# Altium project motor_board.PrjPcb
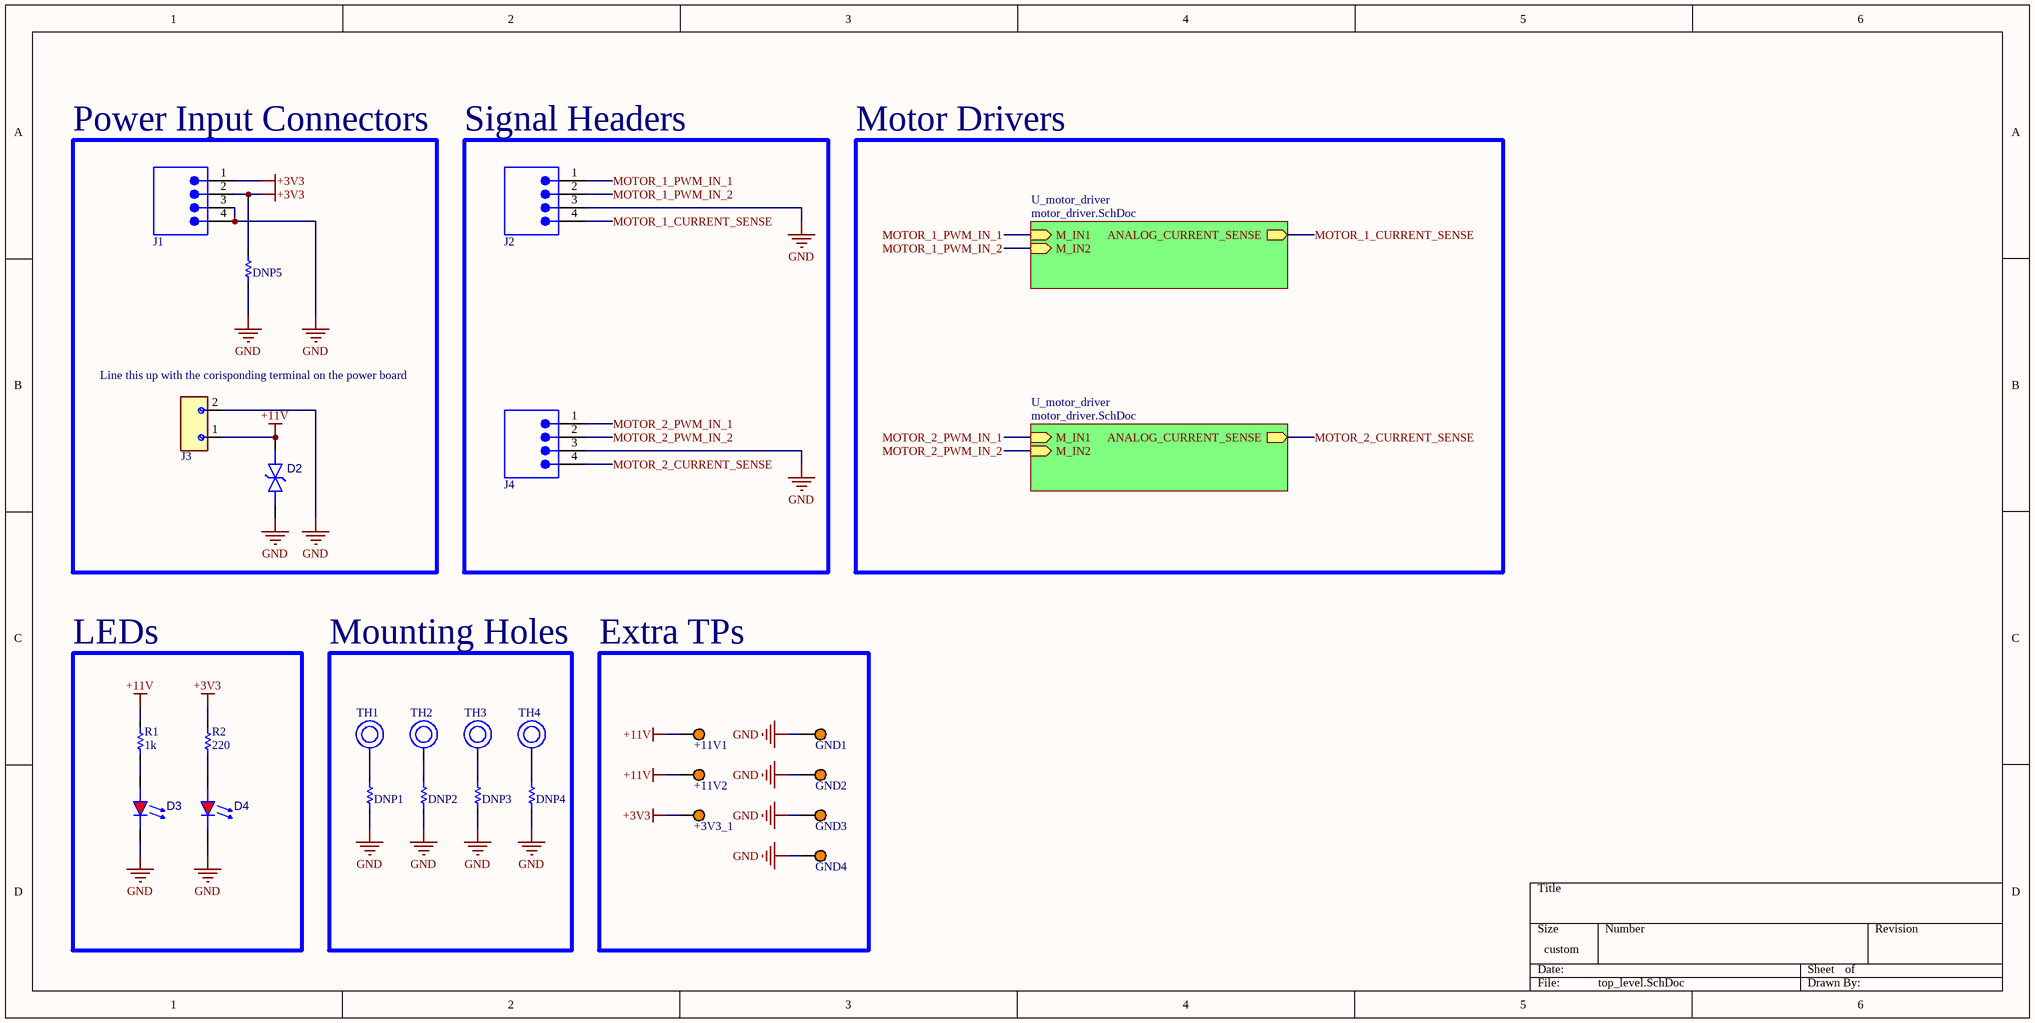
[diagram p0: top_level.SchDoc]
2 sheets, 61 parts. Net scope: hierarchical (ports join the sheet entries above them; power ports are global).
Board file: motor_board.PcbDoc
Sheets:
  top_level.SchDoc
    U_motor_driver = motor_driver.SchDoc
    U_motor_driver = motor_driver.SchDoc

## Sheet top_level.SchDoc
size 381 x 190 mm; SheetNumber: 1; SheetTotal: 2

### Parts
+3V3_1  TP - 5008 (Compact)  [5008 - Keystone Compact Footprint]  (value not drawn)
+11V1  TP - 5008 (Compact)  [5008 - Keystone Compact Footprint]  (value not drawn)
+11V2  TP - 5008 (Compact)  [5008 - Keystone Compact Footprint]  (value not drawn)
D2  D - SMAJ15CA  [D - SMAJ15CA]  (value not drawn)
D3  D - LTST-C193KRKT-5A  [LED 0603]  (value not drawn)
D4  D - LTST-C193KRKT-5A  [LED 0603]  (value not drawn)
DNP1  DNP - DNP PAD 0603  [DNP 0603]  (value not drawn)
DNP2  DNP - DNP PAD 0603  [DNP 0603]  (value not drawn)
DNP3  DNP - DNP PAD 0603  [DNP 0603]  (value not drawn)
DNP4  DNP - DNP PAD 0603  [DNP 0603]  (value not drawn)
DNP5  DNP - DNP PAD 0603  [DNP 0603]  (value not drawn)
GND1  TP - 5008 (Compact)  [5008 - Keystone Compact Footprint]  (value not drawn)
GND2  TP - 5008 (Compact)  [5008 - Keystone Compact Footprint]  (value not drawn)
GND3  TP - 5008 (Compact)  [5008 - Keystone Compact Footprint]  (value not drawn)
GND4  TP - 5008 (Compact)  [5008 - Keystone Compact Footprint]  (value not drawn)
J1  Copy of SMTC-TSW-106-07-X-D_1  [J - 61300411121]  (value not drawn)
J2  Copy of SMTC-TSW-106-07-X-D_1  [J - 61300411121]  (value not drawn)
J3  J - 691137710002  [J - 691137710002]  (value not drawn)
J4  Copy of SMTC-TSW-106-07-X-D_1  [J - 61300411121]  (value not drawn)
R1  value 1k  [RES 0603]  (hidden comment: ERJ-PB3B1001V)
R2  value 220  [RES 0603]  (hidden comment: R - RES 220R 0.33W 1% 0603)
TH1  TH - M3 Mounting Hole  [M3 Mounting]  (value not drawn)
TH2  TH - M3 Mounting Hole  [M3 Mounting]  (value not drawn)
TH3  TH - M3 Mounting Hole  [M3 Mounting]  (value not drawn)
TH4  TH - M3 Mounting Hole  [M3 Mounting]  (value not drawn)

### Blocks framed on the sheet
Power Input Connectors: D2 DNP5 J1 J3
Signal Headers: J2 J4
LEDs: D3 D4 R1 R2
Mounting Holes: DNP1-DNP4 TH1-TH4
Extra TPs: +3V3_1 +11V1 +11V2 GND1-GND4

### Sub-sheets
U_motor_driver = motor_driver.SchDoc: M_IN1 (in), M_IN2 (in), ANALOG_CURRENT_SENSE (out)
U_motor_driver = motor_driver.SchDoc: M_IN1 (in), M_IN2 (in), ANALOG_CURRENT_SENSE (out)

### Nets
+3V3: +3V3_1.1 DNP5.2 J1.1 J1.2 R2.2
+11V: +11V1.1 +11V2.1 D2.2(A) J3.1 R1.2
GND: D2.1(K) D3.2(K) D4.2(K) DNP1.2 DNP2.2 DNP3.2 DNP4.2 DNP5.1 GND1.1 GND2.1 GND3.1 GND4.1 J1.3 J1.4 J2.3 J3.2 J4.3
MOTOR_1_CURRENT_SENSE: J2.4 ; sheet U_motor_driver/ANALOG_CURRENT_SENSE
MOTOR_1_PWM_IN_1: J2.1 ; sheet U_motor_driver/M_IN1
MOTOR_1_PWM_IN_2: J2.2 ; sheet U_motor_driver/M_IN2
MOTOR_2_CURRENT_SENSE: J4.4 ; sheet U_motor_driver/ANALOG_CURRENT_SENSE
MOTOR_2_PWM_IN_1: J4.1 ; sheet U_motor_driver/M_IN1
MOTOR_2_PWM_IN_2: J4.2 ; sheet U_motor_driver/M_IN2
NetD3_1: D3.1(A) R1.1
NetD4_1: D4.1(A) R2.1
NetDNP1_1: DNP1.1 TH1.1
NetDNP2_1: DNP2.1 TH2.1
NetDNP3_1: DNP3.1 TH3.1
NetDNP4_1: DNP4.1 TH4.1

### Notes on the sheet
- Motor Drivers
- (near J3) Line this up with the corisponding terminal on the power board

### Library data of the parts
+3V3_1 +11V1 +11V2 GND1-GND4 = TP - 5008 (Compact): 5008 - Orange PC Test Point, Compact Phosphor Bronze Silver Plating Through Hole Mounting Type
D2 = D - SMAJ15CA: SMAJ15CA - 24.4V Clamp 16.4A Ipp Tvs Diode Surface Mount DO-214AC (SMA)
D3 D4 = D - LTST-C193KRKT-5A: LTST-C193KRKT-5A - Red 631nm LED Indication - Discrete 2V 0603 (1608 Metric)
J1 J2 J4 = J - 61300411121: 61300411121 - Connector Header Through Hole 4 position 0.100" (2.54mm)
J3 = J - 691137710002: 691137710002 - 2 Position Wire to Board Terminal Block Horizontal with Board 0.197" (5.00mm) Through Hole
R1 = R - RES 1kR 0.2W 0.1% 0603: ERJ-PB3B1001V - 1 kOhms ±0.1% 0.2W, 1/5W Chip Resistor 0603 (1608 Metric) Automotive AEC-Q200 Thick Film
R2 = R - RES 220R 0.33W 1% 0603: ERJ-PA3F2200V - 220 Ohms ±1% 0.333W, 1/3W Chip Resistor 0603 (1608 Metric) Automotive AEC-Q200, Pulse Withstanding Thick Film

## Sheet motor_driver.SchDoc
size A; SheetNumber: 2; SheetTotal: 2
Used 2 times, as channels U_motor_driver, U_motor_driver. Parts and nets are listed once, with the designators drawn on the sheet.
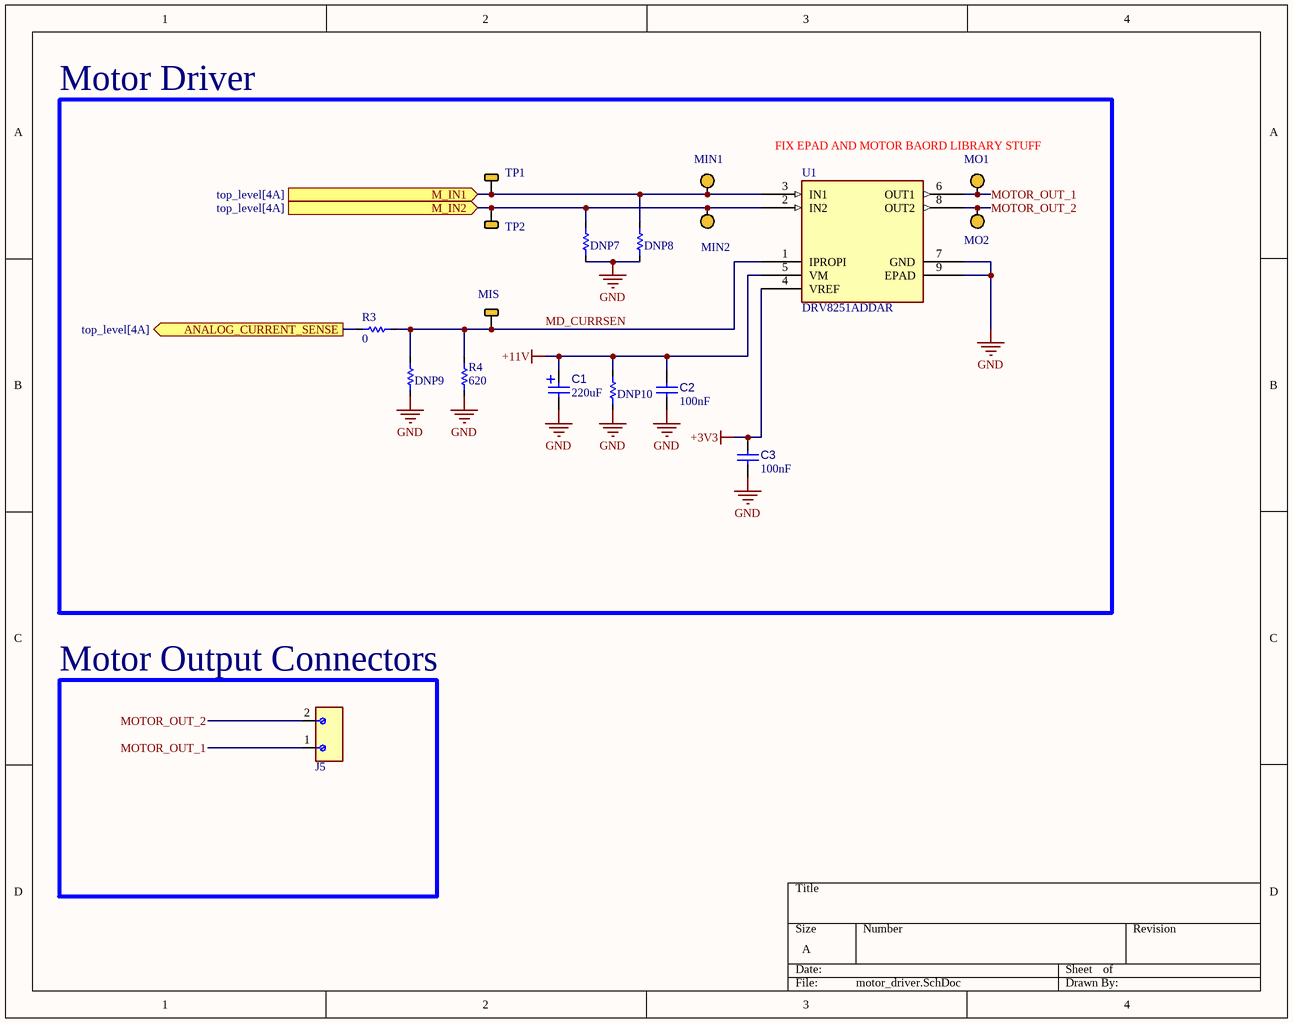
[diagram p1: motor_driver.SchDoc]

### Parts
C1  value 220uF  [C - 860020574012]  (hidden comment: 860020574012)
C2  value 100nF  [CAP_0603]  (hidden comment: C - CAP CER 100nF 100V 10% 0603)
C3  value 100nF  [CAP_0603]  (hidden comment: C - CAP CER 100nF 100V 10% 0603)
DNP7  DNP - DNP PAD 0603  [DNP 0603]  (value not drawn)
DNP8  DNP - DNP PAD 0603  [DNP 0603]  (value not drawn)
DNP9  DNP - DNP PAD 0603  [DNP 0603]  (value not drawn)
DNP10  DNP - DNP PAD 0603  [DNP 0603]  (value not drawn)
J5  J - 691137710002  [J - 691137710002]  (value not drawn)
MIN1  TP - SMD Pad Test Point Circular  [TP - SMD Pad Testpoint]  (value not drawn)
MIN2  TP - SMD Pad Test Point Circular  [TP - SMD Pad Testpoint]  (value not drawn)
MIS  SMD Pad Testpoint Rectangular (Signal)  [SMD Pad Testpoint Rectangular (Signal)]  (value not drawn)
MO1  TP - SMD Pad Test Point Circular  [TP - SMD Pad Testpoint]  (value not drawn)
MO2  TP - SMD Pad Test Point Circular  [TP - SMD Pad Testpoint]  (value not drawn)
R3  value 0  [RES 0603]  (hidden comment: R - RES 0R 0.1W N/A% 0603)
R4  value 620  [RES 0603]  (hidden comment: R - RES 620R 0.33W 1% 0603)
TP1  SMD Pad Testpoint Rectangular (Signal)  [SMD Pad Testpoint Rectangular (Signal)]  (value not drawn)
TP2  SMD Pad Testpoint Rectangular (Signal)  [SMD Pad Testpoint Rectangular (Signal)]  (value not drawn)
U1  DRV8251ADDAR  [U - DRV8251ADDAR]

### Blocks framed on the sheet
Motor Driver: C1-C3 DNP7-DNP10 MIN1 MIN2 MIS MO1 MO2 R3 R4 TP1 TP2 U1
Motor Output Connectors: J5

### Ports
ANALOG_CURRENT_SENSE (out, see top_level[4A]), M_IN1 (in, see top_level[4A]), M_IN2 (in, see top_level[4A])

### Nets
+3V3: C3.2 U1.4(VREF)
+11V: C1.1(POS) C2.2 DNP10.2 U1.5(VM)
GND: C1.2(NEG) C2.1 C3.1 DNP7.1 DNP8.1 DNP9.1 DNP10.1 R4.1 U1.7(GND) U1.9(EPAD)
ANALOG_CURRENT_SENSE: R3.1 ; port ANALOG_CURRENT_SENSE
M_IN1: DNP8.2 MIN1.1 TP1.1 U1.3(IN1) ; port M_IN1
M_IN2: DNP7.2 MIN2.1 TP2.1 U1.2(IN2) ; port M_IN2
MD_CURRSEN: DNP9.2 MIS.1 R3.2 R4.2 U1.1(IPROPI)  [project net MD_CURRSEN_2]
MOTOR_OUT_1: J5.1 MO1.1 U1.6(OUT1)  [project net MOTOR_OUT_1_2]
MOTOR_OUT_2: J5.2 MO2.1 U1.8(OUT2)  [project net MOTOR_OUT_2_2]

### Channels
U_motor_driver: designators C1=C1_2 C2=C2_2 C3=C3_2 DNP7=DNP7_2 DNP8=DNP8_2 DNP9=DNP9_2 DNP10=DNP10_2 J5=J5_2 MIN1=MIN1_M1 MIN2=MIN2_M1 MIS=MIS_2 MO1=MO1_2 MO2=MO2_2 R3=R3_2 R4=R4_2 TP1=TP1_2 TP2=TP2_2 U1=U1_2; ports ANALOG_CURRENT_SENSE=MOTOR_1_CURRENT_SENSE M_IN1=MOTOR_1_PWM_IN_1 M_IN2=MOTOR_1_PWM_IN_2
U_motor_driver: designators C1=C1_1 C2=C2_1 C3=C3_1 DNP7=DNP7_1 DNP8=DNP8_1 DNP9=DNP9_1 DNP10=DNP10_1 J5=J5_1 MIN1=MIN1_M2 MIN2=MIN2_M2 MIS=MIS_1 MO1=MO1_1 MO2=MO2_1 R3=R3_1 R4=R4_1 TP1=TP1_1 TP2=TP2_1 U1=U1_1; ports ANALOG_CURRENT_SENSE=MOTOR_2_CURRENT_SENSE M_IN1=MOTOR_2_PWM_IN_1 M_IN2=MOTOR_2_PWM_IN_2

### Notes on the sheet
- FIX EPAD AND MOTOR BAORD LIBRARY STUFF

### Library data of the parts
C1 = C - CAP ELC 220uF 35V 20% CAN: 860020574012 - 220 µF 35 V Aluminum Electrolytic Capacitors Radial, Can 2000 Hrs @ 105°C; Parameter 2: *
C2 C3 = C - CAP CER 100nF 100V 10% 0603: GRM188R72A104KA35D - 0.1 µF ±10% 100V Ceramic Capacitor X7R 0603 (1608 Metric); Parameter 2: *
J5 = J - 691137710002: as J3 on sheet top_level
MIN1 MIN2 MO1 MO2 = TP - SMD Pad Test Point Circular: Pad Test Point, Circular, 1mm Diameter.
MIS TP1 TP2 = SMD Pad Testpoint Rectangular (Signal): SMD Pad Test Point, No Stencil, Rectangular, 1mm Long, 0.3 (12mil) Wide, For Signal Traces.
R3 = R - RES 0R 0.1W N/A% 0603: ERJ-3GEY0R00V - 0 Ohms Jumper Chip Resistor 0603 (1608 Metric) Automotive AEC-Q200 Thick Film
R4 = R - RES 620R 0.33W 1% 0603: ERJ-PA3F6200V - 620 Ohms ±1% 0.333W, 1/3W Chip Resistor 0603 (1608 Metric) Automotive AEC-Q200, Pulse Withstanding Thick Film
U1 = U - DRV8251ADDAR: DRV8251ADDAR - 50-V, 4.1-A H-bridge motor driver with integrated current regulation & current-sense feedback 8-SO PowerPAD -40 to 150

## Nets that join several sheets
+3V3: top_level (5 pins), U_motor_driver (C3_2.2 U1_2.4), U_motor_driver (C3_1.2 U1_1.4)
+11V: top_level (5 pins), U_motor_driver (C1_2.1 C2_2.2 DNP10_2.2 U1_2.5), U_motor_driver (C1_1.1 C2_1.2 DNP10_1.2 U1_1.5)
GND: top_level (17 pins), U_motor_driver (10 pins), U_motor_driver (10 pins)
MOTOR_1_CURRENT_SENSE: top_level (J2.4), U_motor_driver (R3_2.1)
MOTOR_1_PWM_IN_1: top_level (J2.1), U_motor_driver (DNP8_2.2 MIN1_M1.1 TP1_2.1 U1_2.3)
MOTOR_1_PWM_IN_2: top_level (J2.2), U_motor_driver (DNP7_2.2 MIN2_M1.1 TP2_2.1 U1_2.2)
MOTOR_2_CURRENT_SENSE: top_level (J4.4), U_motor_driver (R3_1.1)
MOTOR_2_PWM_IN_1: top_level (J4.1), U_motor_driver (DNP8_1.2 MIN1_M2.1 TP1_1.1 U1_1.3)
MOTOR_2_PWM_IN_2: top_level (J4.2), U_motor_driver (DNP7_1.2 MIN2_M2.1 TP2_1.1 U1_1.2)